# EAGLE design CR78-GU (EAGLE 7.6.0)
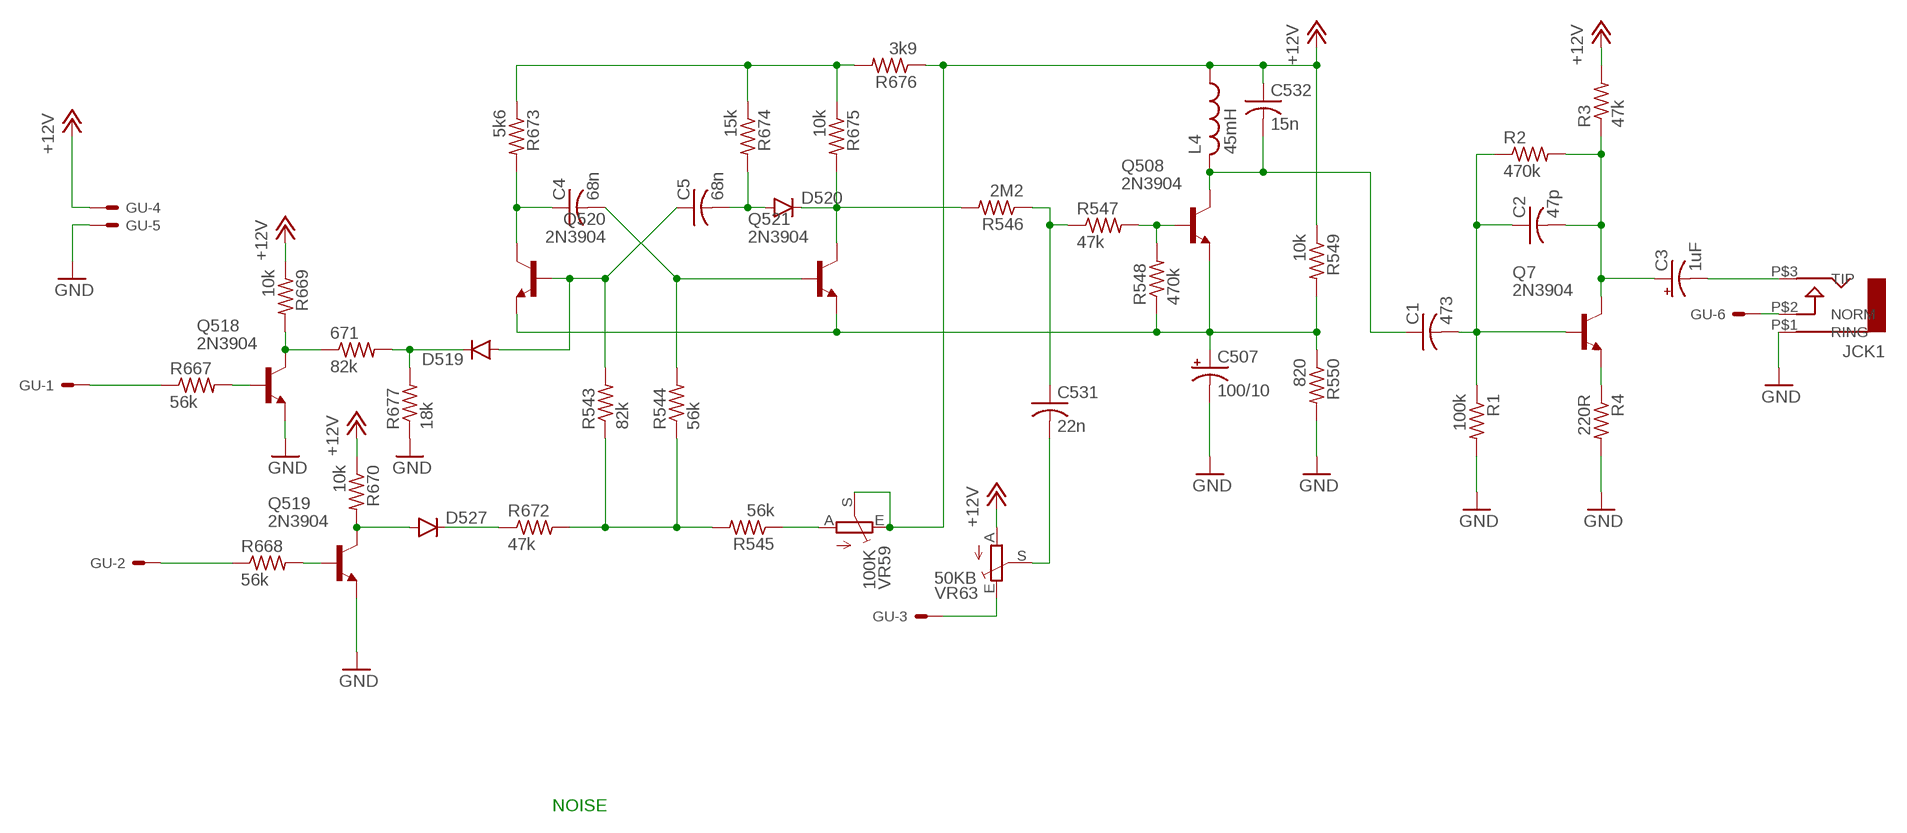
[diagram p0: schematic, sheet 1]

## Parts
671  82k  R-US_0207/7  [0207/7]
C1  473  C-US050-025X075  [C050-025X075]
C2  47p  C-US050-025X075  [C050-025X075]
C3  1uF  CPOL-USB45181A  [B45181A]
C4  68n  C-US050-025X075  [C050-025X075]
C5  68n  C-US050-025X075  [C050-025X075]
C507  100/10  CPOL-USB45181A  [B45181A]
C531  22n  C-US050-025X075  [C050-025X075]
C532  15n  C-US050-025X075  [C050-025X075]
D519  DIODE1N4148  [DIODE-1N4148]
D520  DIODE1N4148  [DIODE-1N4148]
D527  DIODE1N4148  [DIODE-1N4148]
GU  22-23-2061  [22-23-2061]
JCK1  AUDIO-JACK  [ERTHENVAR-JACK-90DEG]
L4  45mH  L-US0204/7  [0204/7]
Q7  2N3904  [TO92]
Q508  2N3904  [TO92]
Q518  2N3904  [TO92]
Q519  2N3904  [TO92]
Q520  2N3904  [TO92]
Q521  2N3904  [TO92]
R1  100k  R-US_0207/7  [0207/7]
R2  470k  R-US_0207/7  [0207/7]
R3  47k  R-US_0207/7  [0207/7]
R4  220R  R-US_0207/7  [0207/7]
R543  82k  R-US_0207/7  [0207/7]
R544  56k  R-US_0207/7  [0207/7]
R545  56k  R-US_0207/7  [0207/7]
R546  2M2  R-US_0207/7  [0207/7]
R547  47k  R-US_0207/7  [0207/7]
R548  470k  R-US_0207/7  [0207/7]
R549  10k  R-US_0207/7  [0207/7]
R550  820  R-US_0207/7  [0207/7]
R667  56k  R-US_0207/7  [0207/7]
R668  56k  R-US_0207/7  [0207/7]
R669  10k  R-US_0207/7  [0207/7]
R670  10k  R-US_0207/7  [0207/7]
R672  47k  R-US_0207/7  [0207/7]
R673  5k6  R-US_0207/7  [0207/7]
R674  15k  R-US_0207/7  [0207/7]
R675  10k  R-US_0207/7  [0207/7]
R676  3k9  R-US_0207/7  [0207/7]
R677  18k  R-US_0207/7  [0207/7]
VR59  100K  TRIM_EU-B64Y  [B64Y]
VR63  50KB  TRIM_EU-B64Y  [B64Y]

## Nets
+12V: C532.1 GU.4 L4.1 R3.2 R549.1 R669.1 R670.1 R676.1 VR59.E VR59.S VR63.A
GND: C507.- GU.5 JCK1.P$1(RING) Q518.3(E) Q519.3(E) R1.2 R4.2 R550.2 R677.1
N$1: 671.2 D519.C R677.2
N$2: C5.1 D519.A Q520.2(B) R543.2
N$3: GU.3 VR63.E
N$4: C507.+ Q508.3(E) Q520.3(E) Q521.3(E) R548.1 R549.2 R550.1
N$5: D520.C Q521.1(C) R546.2 R675.2
N$6: C5.2 D520.A R674.2
N$7: GU.6 JCK1.P$2(NORM)
N$8: C4.2 Q521.2(B) R544.2
N$9: C4.1 Q520.1(C) R673.2
N$10: R673.1 R674.1 R675.1 R676.2
N$11: GU.2 R668.1
N$12: C531.1 R546.1 R547.1
N$13: Q508.2(B) R547.2 R548.2
N$14: R545.1 VR59.A
N$15: Q7.3(E) R4.1
N$16: C2.2 C3.+ Q7.1(C) R2.2 R3.1
N$17: C531.2 VR63.S
N$18: C1.2 C2.1 Q7.2(B) R1.1 R2.1
N$19: C3.- JCK1.P$3(TIP)
N$20: 671.1 Q518.1(C) R669.2
N$21: Q518.2(B) R667.2
N$22: R543.1 R544.1 R545.2 R672.2
N$23: D527.C R672.1
N$24: GU.1 R667.1
N$27: C1.1 C532.2 L4.2 Q508.1(C)
N$46: D527.A Q519.1(C) R670.2
N$47: Q519.2(B) R668.2

## Notes on the sheet
- NOISE

## Library data of the parts
671 R1-R4 R543-R550 R667-R670 R672-R677 = rcl:R-US_: RESISTOR, American symbol
C1 C2 C4 C5 C531 C532 = rcl:C-US: CAPACITOR, American symbol
C3 C507 = rcl:CPOL-US: POLARIZED CAPACITOR, American symbol
D519 D520 D527 = SparkFun-DiscreteSemi:DIODE: Diode These are standard reverse protection diodes and small signal diodes. SMA package can handle up to about 1A. SOD-323 can handle about 200mA. What the SOD-323 package when ordering, there are some mfgs out there that are 5-pin packages.
GU = con-molex:22-23-2061: .100" (2.54mm) Center Header - 6 Pin; MF: MOLEX; MPN: 22-23-2061; OC_FARNELL: 1462922; OC_NEWARK: 27C1933
JCK1 = erthenvar:AUDIO-JACK: Switching Mono 3.5mm Audio Jack from Erthenvar.
L4 = rcl:L-US: INDUCTOR, American symbol
Q7 Q508 Q518-Q521 = 808_lt:2N3904: NPN Transistor
VR59 VR63 = TR808clone:TRIM_EU-: POTENTIOMETER

## Net classes
0 default: width 0.635 mm, drill 0.254 mm, clearance 0.254 mm
1 GND: width 1.016 mm, drill 1.016 mm, clearance 0.508 mm

## Board
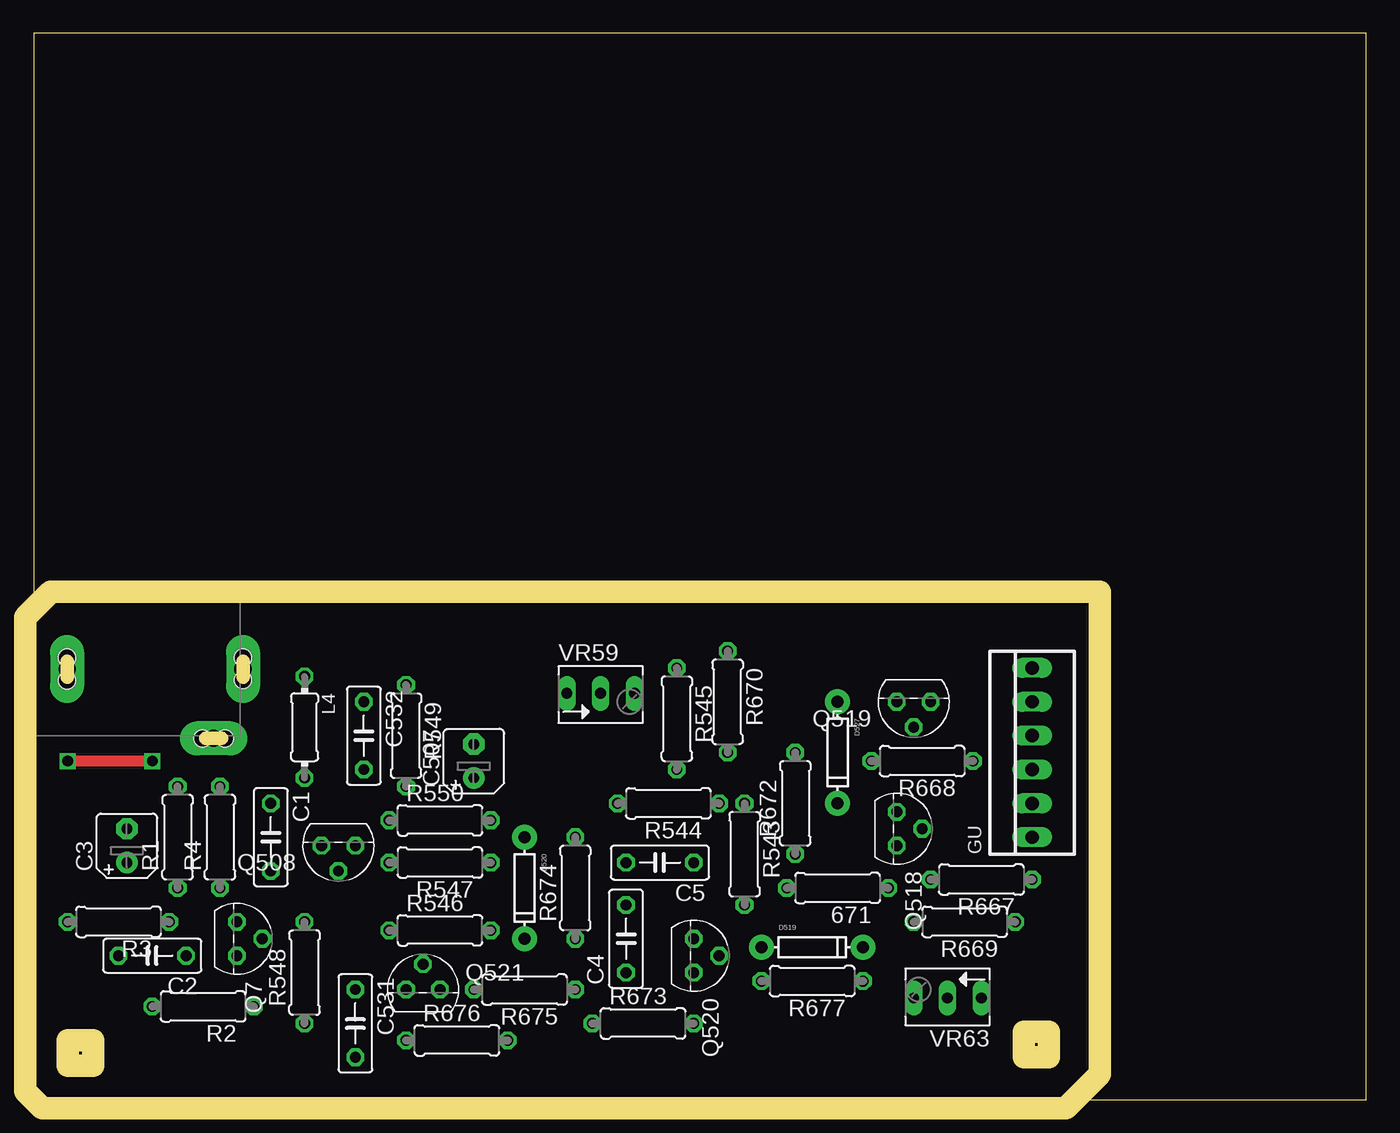
[diagram p1: board, top side]
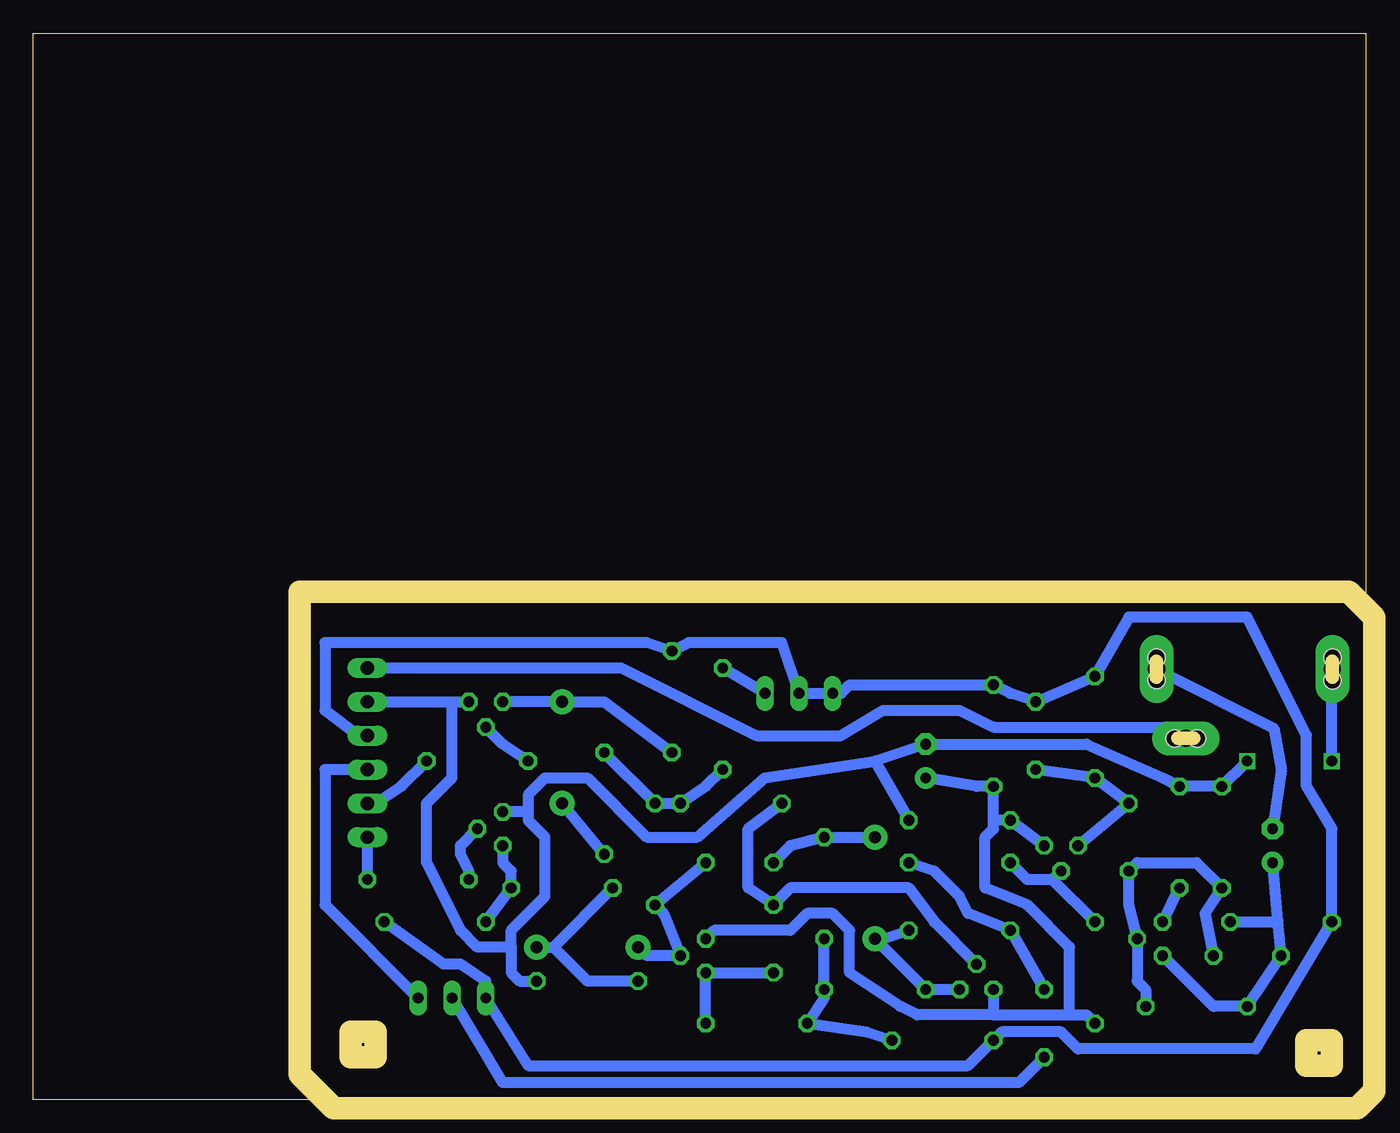
[diagram p2: board, bottom side, seen from below]

Size 100 x 80 mm. Coordinates in mm from the lower left corner, seen from the top.
Outline: 0,0 100,0 100,80 0,80 0,0
Copper layers (1*16): Top 0.035mm / dielectric 1.5mm / Bottom 0.035mm
Design rules "default *": minimum track width 32mil, minimum drill 31mil, track to track 18mil, track to pad 18mil, pad to pad 18mil, via to via 18mil, smd to smd 8mil, copper to edge 0mil, drill to drill 18mil, minimum pad ring 10mil, minimum via ring 8mil, stop-mask expansion 4mil, vias tented up to drill 0mil, thermal gap 10mil
Milling: 15 lines

### Footprints (pad centres in the part's own frame; a part is rotated, then mirrored left to right if it is on the bottom)
0207/7 = drill 0.813 octagon: 1 -3.81,0; 2 3.81,0
C050-025X075 = drill 0.813 octagon: 1 -2.54,0; 2 2.54,0
B45181A = drill 0.813 pad 1.6: + -1.27,0 | drill 0.813 pad 1.6 octagon: - 1.27,0
DIODE-1N4148 = drill 0.9 pad 1.88: A -3.81,0; C 3.81,0
22-23-2061 = drill 1 long: 1 -6.35,0; 2 -3.81,0; 3 -1.27,0; 4 1.27,0; 5 3.81,0; 6 6.35,0
ERTHENVAR-JACK-90DEG = drill 1.3 pad 2.54 long: P$1 5,-2.5; P$2 -0.2,-13.5; P$3 5,-15.7 | hole 1.3: 5.842,-2.489; 4.14,-2.489; -0.203,-12.649; -0.203,-14.351; 5.842,-15.697; 4.166,-15.697
0204/7 = drill 0.813 octagon: 1 -3.81,0; 2 3.81,0
TO92 = drill 0.813 octagon: 1 1.27,0; 2 0,1.905; 3 -1.27,0
B64Y = drill 0.813 long: A 2.54,0; E -2.54,0; S 0,0

### Placement (x,y rotation side)
671  60.33,15.88 180 top
C1  17.78,19.68 270 top
C2  8.89,10.79 180 top
C3  6.99,19.05 90 top
C4  44.45,12.06 90 top
C5  46.99,17.78 180 top
C507  33.02,25.4 90 top
C531  24.13,5.71 270 top
C532  24.77,27.3 270 top
D519  58.42,11.43 0 top
D520  36.83,15.88 270 top
D527  60.33,26.04 270 top
GU  74.93,26.04 90 top
JCK1  0,27.3 90 top
L4  20.32,27.94 270 top
Q7  15.24,12.06 270 top
Q508  22.86,19.05 180 top
Q518  64.77,20.32 270 top
Q519  66.04,29.84 180 top
Q520  49.53,10.79 270 top
Q521  29.21,8.26 0 top
R1  10.79,19.68 90 top
R2  12.7,6.99 180 top
R3  6.35,13.34 180 top
R4  13.97,19.68 90 top
R543  53.34,18.41 270 top
R544  47.62,22.23 180 top
R545  48.26,28.57 270 top
R546  30.48,12.7 0 top
R547  30.48,17.78 180 top
R548  20.32,9.53 90 top
R549  27.94,27.3 270 top
R550  30.48,20.95 0 top
R667  71.12,16.51 180 top
R668  66.67,25.4 180 top
R669  69.85,13.34 180 top
R670  52.07,29.84 270 top
R672  57.15,22.23 90 top
R673  45.72,5.71 0 top
R674  40.64,15.88 90 top
R675  36.83,8.26 180 top
R676  31.75,4.45 0 top
R677  58.42,8.89 180 top
VR59  42.55,30.48 0 top
VR63  68.58,7.62 180 top

### Tracks (layer width: path | path; a pad name or v marks a point on that pad's centre or on a via)
+12V
  Bottom 0.813: GU.4 75.56,27.3 78.11,29.21 78.11,34.29 53.98,34.29 R670.1 50.8,34.29 43.81,34.29 VR59.S VR59.E 39.37,30.48 38.73,31.11 R549.1 26.67,30.48 C532.1 L4.1 17.78,36.2 8.89,36.2 4.45,27.3 4.45,23.5 2.54,20.32 R3.2 8.26,3.81 21.59,3.81 22.86,5.08 27.3,5.08 R676.1 29.84,2.54 62.87,2.54 VR63.A 66.04,8.89 67.94,10.16 69.22,10.16 R669.1
GND  (via drill 0.8)
  Top 0.813: v8.89,25.4 v2.54,25.4
  Bottom 0.813: 36.83,25.4 C507.- 20.95,26.67 15.24,24.13 R4.2 R1.2 v8.89,25.4 | 36.83,25.4 R550.2 | GU.5 68.58,29.84 | 64.14,11.43 64.14,12.7 61.59,15.24 61.59,19.68 62.87,20.95 62.87,21.59 | 68.58,29.84 68.58,24.13 70.48,22.23 70.48,17.78 67.94,12.7 66.67,11.43 64.14,11.43 | 68.58,29.84 Q519.3 | 36.83,25.4 45.09,24.13 50.16,19.68 53.98,19.68 58.42,24.13 61.59,24.13 62.87,22.86 62.87,21.59 | v2.54,25.4 2.54,30.44 JCK1.P$1 | 64.14,11.43 64.14,9.53 63.5,8.89 R677.1 | 62.87,21.59 Q518.3
N$1
  Bottom 0.813: D519.C 60.96,11.43 | 60.96,11.43 671.2 | R677.2 58.42,8.89 60.96,11.43
N$2
  Bottom 0.813: C5.1 R543.2 52.7,13.97 Q520.2 53.98,10.79 D519.A
N$3
  Bottom 0.813: VR63.E 78.11,14.61 78.11,24.77 GU.3
N$4
  Bottom 0.813: 27.94,20.95 R549.2 29.21,23.5 C507.+ | 27.94,20.95 R550.1 Q508.3 | Q520.3 48.9,12.7 43.18,12.7 41.91,13.97 40.01,13.97 38.73,12.7 38.73,9.53 34.92,6.99 33.66,6.35 27.94,6.35 | Q521.3 27.94,6.35 | R548.1 20.95,6.35 22.23,6.35 | 27.94,6.35 22.23,6.35 | 27.94,20.95 27.94,20.32 28.57,19.68 28.57,15.88 25.4,14.61 22.23,11.43 22.23,6.35
N$5
  Bottom 0.813: Q521.1 R675.2 D520.C 36.2,12.06 R546.2
N$6
  Bottom 0.813: C5.2 43.18,19.05 R674.2 D520.A
N$7
  Bottom 0.813: GU.6 55.88,32.38 45.72,27.3 39.37,27.3 36.2,29.21 30.48,29.21 27.94,27.94 14.97,27.94 JCK1.P$2
N$8
  Bottom 0.813: R544.2 46.35,20.32 46.35,15.88 C4.2 43.18,15.88 34.29,15.88 32.38,13.34 Q521.2
N$9
  Bottom 0.813: R673.2 Q520.1 C4.1
N$10
  Bottom 0.813: R674.1 R675.1 40.64,7.62 R673.1 37.47,5.08 R676.2
N$11
  Bottom 0.813: R668.1 72.39,23.5 74.3,22.23 GU.2
N$12
  Bottom 0.813: R547.1 32.38,17.14 30.48,15.24 29.84,13.97 R546.1 C531.1
N$13
  Bottom 0.813: R547.2 25.4,16.51 23.5,16.51 | 23.5,16.51 R548.2 | 23.5,16.51 Q508.2
N$14
  Bottom 0.813: R545.1 VR59.A
N$15
  Bottom 0.813: Q7.3 R4.1
N$16
  Bottom 0.813: Q7.1 11.43,6.99 R2.2 C2.2 6.59,13.43 | 6.59,13.43 C3.+ | R3.1 6.68,13.34 6.59,13.43
N$17
  Bottom 0.813: VR63.S 64.77,1.27 26.04,1.27 C531.2
N$18
  Bottom 0.813: C2.1 12.06,13.97 R1.1 12.7,17.78 17.14,17.78 C1.2 17.78,14.61 Q7.2 17.14,8.89 16.51,8.26 R2.1
N$19
  Bottom 0.813: JCK1.P$3 6.91,27.86 6.35,24.77 C3.-
N$20
  Bottom 0.813: R669.2 671.1 64.14,17.14 64.77,17.78 Q518.1
N$21
  Bottom 0.813: R667.2 67.31,17.14 67.94,18.41 67.94,19.05 Q518.2
N$22
  Bottom 0.813: R672.2 R543.1 R544.1 49.53,23.5 R545.2
N$23
  Bottom 0.813: D527.C R672.1
N$24
  Bottom 0.813: GU.1 R667.1
N$27
  Bottom 0.813: C532.2 L4.2 C1.1 Q508.1
N$46
  Bottom 0.813: Q519.1 D527.A 57.15,29.84 R670.2
N$47
  Bottom 0.813: Q519.2 64.77,26.67 R668.2